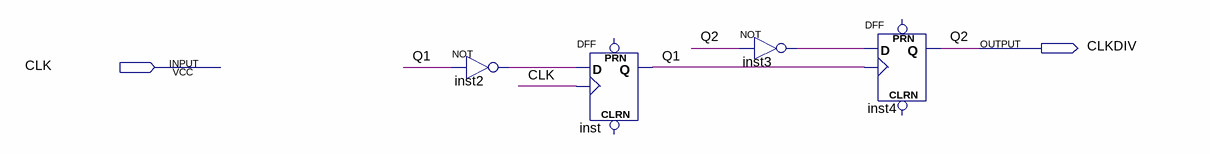
[diagram p0: schematic sheet]
// Quartus schematic CLKDivider_SLOWER.bdf as structural Verilog: 4 symbols, 2 pins
module CLKDivider_SLOWER (
  input  CLK,
  output CLKDIV
);

  wire inst2_out, inst3_out, Q1;

  not inst2 (inst2_out, Q1);
  DFF inst (.CLK(CLK), .D(inst2_out), .Q(Q1));  // open: CLRN, PRN
  not inst3 (inst3_out, CLKDIV);
  DFF inst4 (.CLK(Q1), .D(inst3_out), .Q(CLKDIV));  // open: CLRN, PRN

  // Other names for the same wires on the sheet: Q2 = CLKDIV
endmodule
